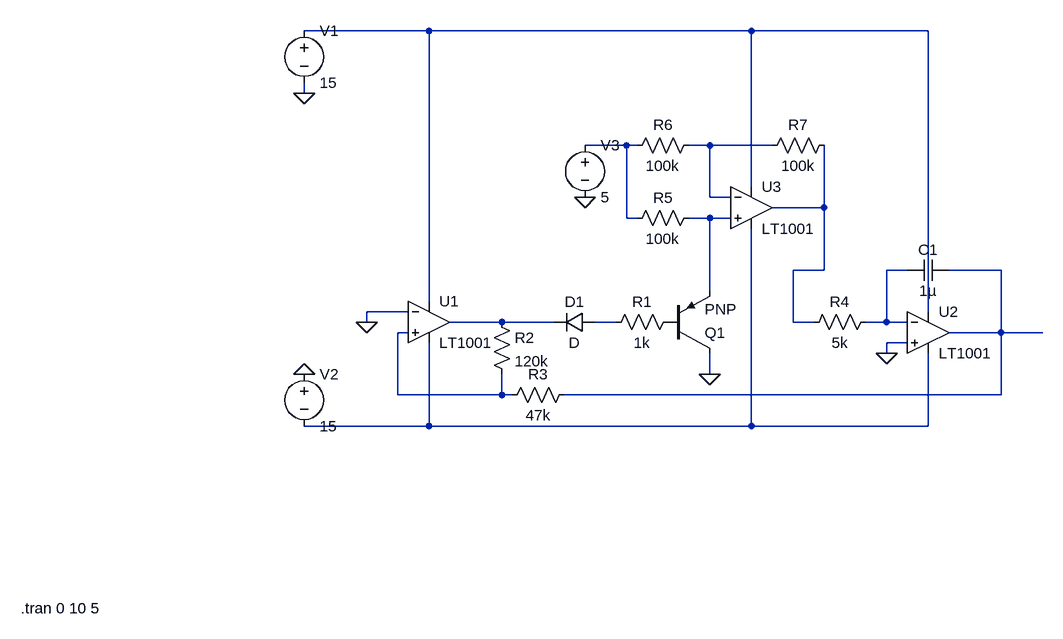
[diagram p0: schematic Triangle oscillator.asc]
Triangle oscillator.asc, the LTspice schematic file:
Version 4
SHEET 1 1476 680
WIRE 528 -528 336 -528
WIRE 1024 -528 528 -528
WIRE 1296 -528 1024 -528
WIRE 336 -432 336 -448
WIRE 832 -352 768 -352
WIRE 848 -352 832 -352
WIRE 960 -352 928 -352
WIRE 1056 -352 960 -352
WIRE 1024 -288 1024 -528
WIRE 960 -272 960 -352
WIRE 992 -272 960 -272
WIRE 1136 -256 1136 -352
WIRE 1136 -256 1056 -256
WIRE 832 -240 832 -352
WIRE 848 -240 832 -240
WIRE 960 -240 928 -240
WIRE 992 -240 960 -240
WIRE 1136 -160 1136 -256
WIRE 1136 -160 1088 -160
WIRE 1264 -160 1232 -160
WIRE 1408 -160 1328 -160
WIRE 960 -128 960 -240
WIRE 528 -112 528 -528
WIRE 496 -96 432 -96
WIRE 1296 -96 1296 -528
WIRE 432 -80 432 -96
WIRE 640 -80 560 -80
WIRE 720 -80 640 -80
WIRE 816 -80 784 -80
WIRE 1088 -80 1088 -160
WIRE 1120 -80 1088 -80
WIRE 1232 -80 1232 -160
WIRE 1232 -80 1200 -80
WIRE 1264 -80 1232 -80
WIRE 496 -64 480 -64
WIRE 1408 -64 1408 -160
WIRE 1408 -64 1328 -64
WIRE 1472 -64 1408 -64
WIRE 1264 -48 1232 -48
WIRE 1232 -32 1232 -48
WIRE 960 0 960 -32
WIRE 480 32 480 -64
WIRE 640 32 640 0
WIRE 640 32 480 32
WIRE 656 32 640 32
WIRE 1408 32 1408 -64
WIRE 1408 32 736 32
WIRE 528 80 528 -48
WIRE 528 80 336 80
WIRE 1024 80 1024 -224
WIRE 1024 80 528 80
WIRE 1296 80 1296 -32
WIRE 1296 80 1024 80
FLAG 432 -80 0
FLAG 1232 -32 0
FLAG 336 -432 0
FLAG 336 0 0
FLAG 960 0 0
FLAG 768 -272 0
SYMBOL Opamps\\LT1001 528 -144 R0
SYMATTR InstName U1
SYMBOL Opamps\\LT1001 1296 -128 R0
SYMATTR InstName U2
SYMBOL res 800 -64 R270
WINDOW 0 32 56 VTop 2
WINDOW 3 0 56 VBottom 2
SYMATTR InstName R1
SYMATTR Value 1k
SYMBOL res 624 -96 R0
SYMATTR InstName R2
SYMATTR Value 120k
SYMBOL res 752 16 R90
WINDOW 0 0 56 VBottom 2
WINDOW 3 32 56 VTop 2
SYMATTR InstName R3
SYMATTR Value 47k
SYMBOL cap 1264 -144 R270
WINDOW 0 32 32 VTop 2
WINDOW 3 0 32 VBottom 2
SYMATTR InstName C1
SYMATTR Value 1µ
SYMBOL voltage 336 -544 R0
WINDOW 123 0 0 Left 2
WINDOW 39 0 0 Left 2
SYMATTR InstName V1
SYMATTR Value 15
SYMBOL voltage 336 -16 R0
WINDOW 123 0 0 Left 2
WINDOW 39 0 0 Left 2
SYMATTR InstName V2
SYMATTR Value 15
SYMBOL diode 784 -96 R90
WINDOW 0 0 32 VBottom 2
WINDOW 3 32 32 VTop 2
SYMATTR InstName D1
SYMBOL res 1216 -96 R90
WINDOW 0 0 56 VBottom 2
WINDOW 3 32 56 VTop 2
SYMATTR InstName R4
SYMATTR Value 5k
SYMBOL pnp 896 -32 M180
SYMATTR InstName Q1
SYMBOL Opamps\\LT1001 1024 -320 R0
SYMATTR InstName U3
SYMBOL res 944 -256 R90
WINDOW 0 0 56 VBottom 2
WINDOW 3 32 56 VTop 2
SYMATTR InstName R5
SYMATTR Value 100k
SYMBOL res 944 -368 R90
WINDOW 0 0 56 VBottom 2
WINDOW 3 32 56 VTop 2
SYMATTR InstName R6
SYMATTR Value 100k
SYMBOL res 1152 -368 R90
WINDOW 0 0 56 VBottom 2
WINDOW 3 32 56 VTop 2
SYMATTR InstName R7
SYMATTR Value 100k
SYMBOL voltage 768 -368 R0
WINDOW 123 0 0 Left 2
WINDOW 39 0 0 Left 2
SYMATTR InstName V3
SYMATTR Value 5
TEXT -100 360 Left 2 !.tran 0 10 5

The netlist it stands for:
* Triangle oscillator.asc
XU1 N010 0 N001 N011 N008 LT1001  ; pins In+ In- V+ V- OUT
XU2 0 N006 N001 N011 N007 LT1001  ; pins In+ In- V+ V- OUT
R1 N009 P001 1k
R2 N008 N010 120k
R3 N007 N010 47k
C1 N006 N007 1µ
V1 N001 0 15
V2 0 N011 15
D1 N009 N008 D
R4 N006 N004 5k
Q1 0 P001 N005 0 PNP
XU3 N005 N003 N001 N011 N004 LT1001  ; pins In+ In- V+ V- OUT
R5 N005 N002 100k
R6 N003 N002 100k
R7 N004 N003 100k
V3 N002 0 5
.model D D
.lib standard.dio
.model NPN NPN
.model PNP PNP
.lib standard.bjt
.tran 0 10 5
.lib LTC.lib
.backanno
.end